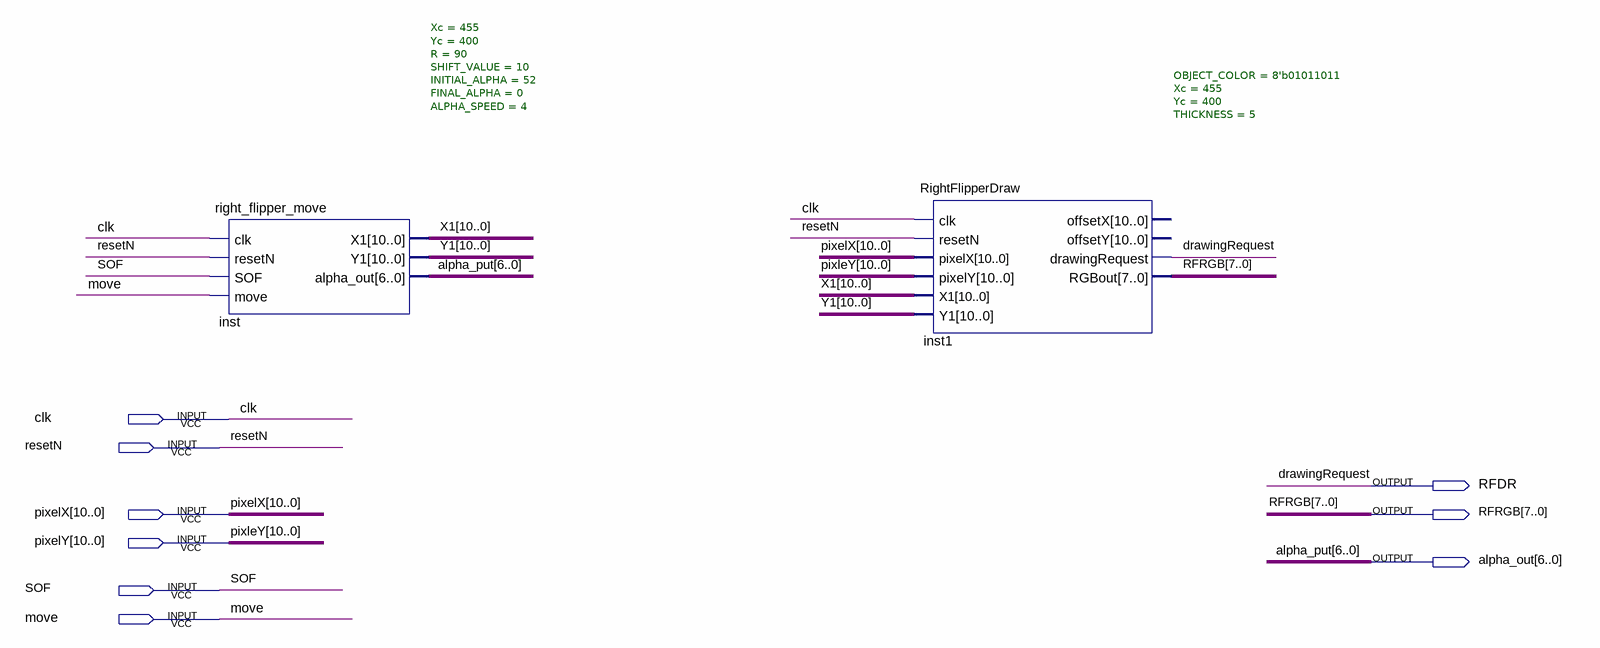
[diagram p0: schematic sheet]
// Quartus schematic RightFlipperBlock.bdf as structural Verilog: 2 symbols, 9 pins
module RightFlipperBlock (
  input  clk,
  input  resetN,
  input  [10:0] pixelX,
  input  [10:0] pixelY,
  input  SOF,
  input  move,
  output RFDR,
  output [7:0] RFRGB,
  output [6:0] alpha_out
);

  wire [10:0] X1, Y1;

  right_flipper_move #(.Xc(455), .Yc(400), .R(90), .SHIFT_VALUE(10), .INITIAL_ALPHA(52), .FINAL_ALPHA(0), .ALPHA_SPEED(4)) inst (
    .clk(clk), .resetN(resetN), .SOF(SOF), .move(move), .X1(X1), .Y1(Y1), .alpha_out(alpha_out));
  RightFlipperDraw #(.OBJECT_COLOR(8'b01011011), .Xc(455), .Yc(400), .THICKNESS(5)) inst1 (
    .clk(clk), .resetN(resetN), .pixelX(pixelX), .pixelY(pixelY), .X1(X1), .Y1(Y1), .drawingRequest(RFDR),
    .RGBout(RFRGB));  // open: offsetX, offsetY

  // Other names for the same wires on the sheet: alpha_put[6:0] = alpha_out; drawingRequest = RFDR;
  //   pixleY[10:0] = pixelY
endmodule
